# Altium schematic sheet EE209_Schematic.SchDoc: Wireless Energy Monitor
size A3; Author: Team XX; Organization: EE/CS 209 Class of 2022; Address1: Department of ECSE; Address2: The University of Auckland; Address3: 20 Symonds Street; Address4: Auckland, NZ; Revision: 1.0; SheetNumber: 1; SheetTotal: 1
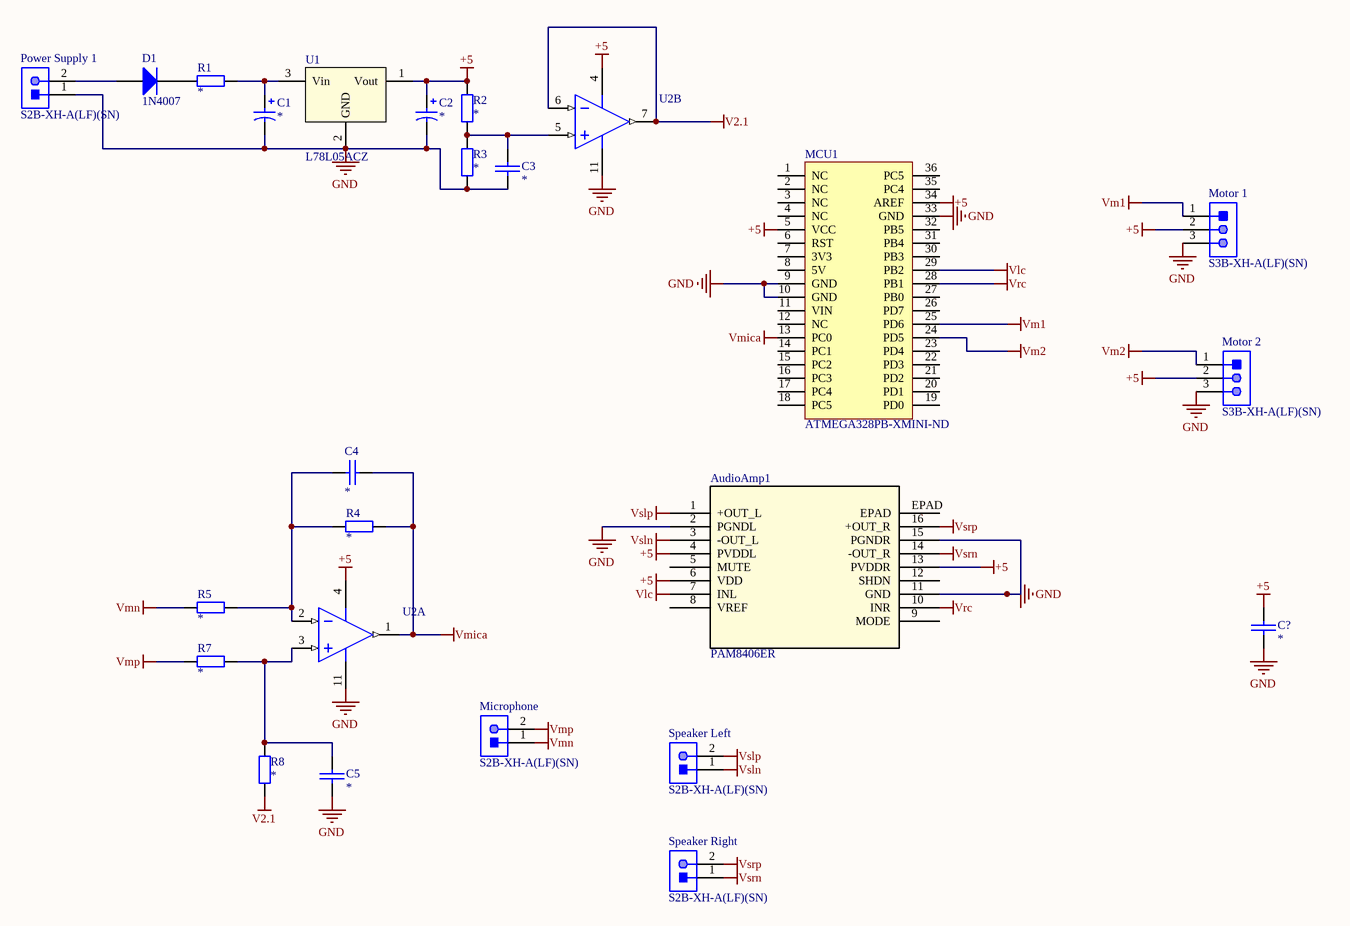
[diagram p0: EE209_Schematic.SchDoc]

## Parts
AudioAmp1  PAM8406ER  [PAM8406ER_DIO]
C1  *  [CAP-RAD-2.5mm Pitch]
C2  *  [CAP-RAD-2.5mm Pitch]
C3  *  [CCAP-5P0]
C4  *  [CCAP-5P0]
C5  *  [CCAP-5P0]
C?  *  [CCAP-5P0]
D1  1N4007  [1N4007-MFG]
MCU1  Supplier Part Number 1: ATMEGA328PB-XMINI-ND  [ATmeg328P Xplained]  (hidden comment: ATmega328PB Xplained Mini Header)
Microphone  S2B-XH-A(LF)(SN)  [JST-S2B-XH-A(LF)(SN)_V]
Motor_1  S3B-XH-A(LF)(SN)  [JST-S3B-XH-A(LF)(SN)_V]
Motor_2  S3B-XH-A(LF)(SN)  [JST-S3B-XH-A(LF)(SN)_V]
Power_Supply_1  S2B-XH-A(LF)(SN)  [JST-S2B-XH-A(LF)(SN)_V]
R1  *  [AXIAL-0.4]
R2  *  [AXIAL-0.4]
R3  *  [AXIAL-0.4]
R4  *  [AXIAL-0.4]
R5  *  [AXIAL-0.4]
R7  *  [AXIAL-0.4]
R8  *  [AXIAL-0.4]
Speaker_Left  S2B-XH-A(LF)(SN)  [JST-S2B-XH-A(LF)(SN)_V]
Speaker_Right  S2B-XH-A(LF)(SN)  [JST-S2B-XH-A(LF)(SN)_V]
U1  L78L05ACZ  [TO-92]
U2  LM324  [DIP-14]  (value not drawn)  (parts A,B of 4)

## Nets
+5: AudioAmp1.4(PVDDL) AudioAmp1.6(VDD) AudioAmp1.13(PVDDR) C2.1 C?.1 MCU1.5(VCC) MCU1.34(AREF) Motor_1.2 Motor_2.2 R2.2 U1.1(Vout) U2.4(VDD)
GND: AudioAmp1.2(PGNDL) AudioAmp1.11(GND) AudioAmp1.15(PGNDR) C1.2 C2.2 C3.2 C5.1 C?.2 MCU1.9(GND) MCU1.10(GND) MCU1.33(GND) Motor_1.3 Motor_2.3 Power_Supply_1.1 R3.1 U1.2(GND) U2.11(VSS)
V2.1: R8.1 U2.6(VINB-) U2.7(VOUTB)
Vlc: AudioAmp1.7(INL) MCU1.29(PB2)
Vm1: MCU1.25(PD6) Motor_1.1
Vm2: MCU1.24(PD5) Motor_2.1
Vmica: C4.2 MCU1.13(PC0) R4.2 U2.1(VOUTA)
Vmn: Microphone.1 R5.2
Vmp: Microphone.2 R7.2
Vrc: AudioAmp1.10(INR) MCU1.28(PB1)
Vsln: AudioAmp1.3(-OUT_L) Speaker_Left.1
Vslp: AudioAmp1.1(+OUT_L) Speaker_Left.2
Vsrn: AudioAmp1.14(-OUT_R) Speaker_Right.1
Vsrp: AudioAmp1.16(+OUT_R) Speaker_Right.2
NetC1_1: C1.1 R1.2 U1.3(Vin)
NetC3_1: C3.1 R2.1 R3.2 U2.5(VINB+)
NetC4_1: C4.1 R4.1 R5.1 U2.2(VINA-)
NetC5_2: C5.2 R7.1 R8.2 U2.3(VINA+)
NetD1_1: D1.1(A) Power_Supply_1.2
NetD1_2: D1.2(K) R1.1

Not connected (* = marked no-connect by the designer): AudioAmp1 5(MUTE) 8(VREF) 9(MODE) 12(SHDN) EPAD; MCU1 1(NC) 2(NC) 3(NC) 4(NC) 6(RST) 7(3V3) 8(5V) 11(VIN) 12(NC) 14(PC1) 15(PC2) 16(PC3) 17(PC4) 18(PC5) 19(PD0) 20(PD1) 21(PD2) 22(PD3) 23(PD4) 26(PD7) 27(PB0) 30(PB3) 31(PB4) 32(PB5) 35(PC4) 36(PC5)

## Notes on the sheet
- Title:
- Author:
- Date:
- Time:
- Revision:
- Sheet
- of
- File:

## Library data of the parts
AudioAmp1 = PAM8406ER: Description; Manufacturer_Name: Diodes Inc; Copyright: Copyright (C) 2025 Ultra Librarian. All rights reserved.; Manufacturer_Part_Number: PAM8406ER; RefDes: RefDes; Type: Type
C1 C2 = ElecCap_TH_2P0: Electrolytic capacitor with radial package, 2mm pitch and 5.2mm diameter; Published: 8-Jun-2000; LatestRevisionDate: 17-Jul-2002; LatestRevisionNote: Re-released for DXP Platform.; PackageReference: POLAR0.8; Publisher: Altium Limited; PackageDescription: Polarized Capacitor; 2 Leads; Value: *
C3-C5 C? = CerCap_TH_5P0: TH ceramic capacitor with 5mm pitch; Value: *
D1 = 1N4007_TH_4AX0: 1N4007 1000V standard axial diode; ComponentLink1URL: https://www.fairchildsemi.com/datasheets/1N/1N914.pdf; ComponentLink1Description: https://www.fairchildsemi.com/datasheets/1N/1N914.pdf; Supplier 1: Digi-Key; Supplier Part Number 1: 1N4007RLGOSCT-ND
MCU1 = ATmega328PBXplained_TH: Dual 18-pin headers connecting to ATmega328PB Xplained Mini; Manufacturer: Microchip Technology; Manufacturer Part Number: ATMEGA328PB-XMINI; Board Type: Evaluation Platform; Core Processor: AVR; Platform: ATmega328P Xplained Mini; Contents: Board(s); Supplier 1: Digi-Key; RoHS: RoHS Compliant; Category: Development Boards, Kits, Programmers; Stock 1: 454; Pricing 1: 1=15.11 (NZD); Part Status: Active; Type: MCU 8-Bit; Operating System: -; For Use With/Related Products: ATmega328P; Mounting Type: Fixed; ComponentLink1URL: http://www.microchip.com/mymicrochip/filehandler.aspx?ddocname=en589665; ComponentLink1Description: http://www.microchip.com/mymicrochip/filehandler.aspx?ddocname=en589665
Microphone Power_Supply_1 Speaker_Left Speaker_Right = CMP-002-00032-2: Male Header, Pitch 2.5 mm, 1 x 2 Position, Height 6.1 mm, Tail Length 3.4 mm, -25 to 85 degC, RoHS, Bulk; Manufacturer: JST; Case/Package: S2B-XH-A(LF)(SN); Package Description: XH Series Disconnectable Crimp Style Connector, Pitch 2.5 mm, 1 x 2 Position, Height 6.1 mm, Tail Length 3.4 mm; Manufacturer URL: http://www.jst.com/home2.html; Datasheet URL: http://www.jst-mfg.com/product/pdf/eng/eXH.pdf; Connector Type: Header; Package Reference: S2B-XH-A(LF)(SN); Mounting Technology: TH; Max Operating Temperature: 85°C; Min Operating Temperature: -25°C; Datasheet Version: May-16; Gender: Male; RoHS Compliant: Unknown
Motor_1 Motor_2 = CMP-002-00033-2: Male Header, Pitch 2.5 mm, 1 x 3 Position, Height 6.1 mm, Tail Length 3.4 mm, -25 to 85 degC, RoHS, Bulk; Manufacturer: JST; Package Description: Male Header, Pitch 2.5 mm, 1 x 3 Position, Height 6.1 mm, Tail Length 3.4 mm; Manufacturer URL: http://www.jst.com/home2.html; Datasheet URL: http://www.jst-mfg.com/product/pdf/eng/eXH.pdf; RoHS Compliant: Unknown; Connector Type: Header; Package Reference: S3B-XH-A(LF)(SN); Gender: Male; Case/Package: S3B-XH-A(LF)(SN); Mounting Technology: TH; Max Operating Temperature: 85°C; Min Operating Temperature: -25°C; Datasheet Version: May-16
R1-R5 R7 R8 = Res_TH_0AX4: Through hole resistor; Published: 8-Jun-2000; LatestRevisionDate: 17-Jul-2002; LatestRevisionNote: Re-released for DXP Platform.; PackageReference: AXIAL-0.4; Publisher: Altium Limited; Value: *; ComponentLink1Description: http://www.royalohm.com/pdf/product2017/PrecisionMetalMF.pdf
U1 = L78L05_TH_TO92: Voltage Regulator 5V; Manufacturer: ON Semiconductor; Manufacturer Part Number: LM78L05ACZX; Output Configuration: Positive; Output Type: Fixed; Voltage - Input (Max): 30V; Current - Output: 100mA; PSRR: 80dB (120Hz); Protection Features: Over Temperature, Short Circuit; Supplier 1: Digi-Key; RoHS: RoHS Compliant; Category: Integrated Circuits (ICs); Stock 1: 7782; Pricing 1: 1=0.69, 10=0.517, 100=0.3226, 500=0.2207, 1000=0.16976 (NZD); Packaging: Cut Tape (CT); Part Status: Active; Voltage - Output (Min/Fixed): 5V; Voltage - Output (Max): -; Voltage Dropout (Max): -; Control Features: -; Operating Temperature: -40°C ~ 125°C; Mounting Type: Through Hole; Package / Case: TO-226-3, TO-92-3 (TO-226AA) (Formed Leads); Supplier Device Package: TO-92-3; Base Part Number: LM78L05; ComponentLink1URL: https://www.fairchildsemi.com/datasheets/MC/MC78L05A.pdf; ComponentLink1Description: https://www.fairchildsemi.com/datasheets/MC/MC78L05A.pdf; Supplier Part Number 1: LM78L05ACZXCT-ND
U2 = LM324N_TH_DIP16: IC OPAMP GP 14DIP; Manufacturer: ON Semiconductor; Manufacturer Part Number: LM324N; Amplifier Type: General Purpose; Current - Supply: 1mA; Voltage - Supply, Single/Dual (±): 3 V ~ 32 V, ±1.5 V ~ 16 V; Supplier 1: Digi-Key; RoHS: RoHS Compliant; Category: Integrated Circuits (ICs); Stock 1: 2900; Pricing 1: 1=0.9, 10=0.775, 100=0.5789, 500=0.45482, 1000=0.35145 (NZD); Packaging: Tube; Part Status: Active; Output Type: -; Slew Rate: -; Operating Temperature: 0°C ~ 70°C; Mounting Type: Through Hole; Package / Case: 14-DIP (0.300", 7.62mm); Supplier Device Package: 14-DIP; Base Part Number: LM324; ComponentLink1URL: https://www.fairchildsemi.com/datasheets/LM/LM2902.pdf; ComponentLink1Description: https://www.fairchildsemi.com/datasheets/LM/LM2902.pdf; Supplier Part Number 1: LM324NFS-ND